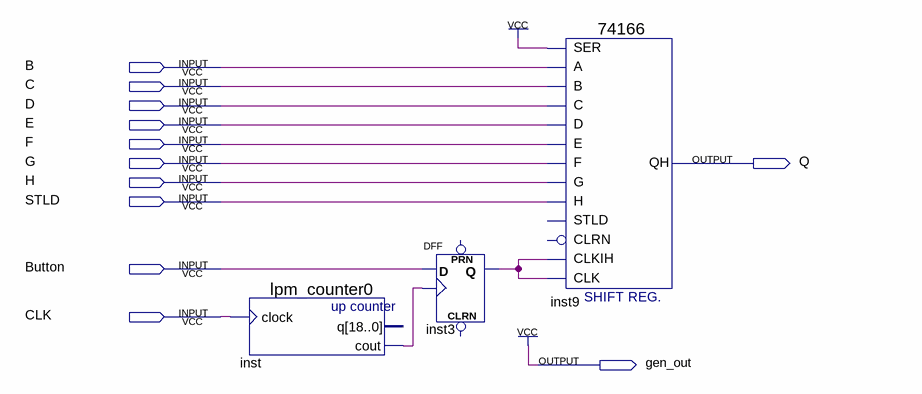
[diagram p0: schematic sheet]
// Quartus schematic scheme3.bdf as structural Verilog: 3 symbols, 12 pins
module scheme3 (
  input  B,
  input  C,
  input  D,
  input  E,
  input  F,
  input  G,
  input  H,
  input  STLD,
  input  Button,
  input  CLK,
  output Q,
  output gen_out
);

  wire inst3_q, inst_cout;

  lpm_counter0 inst (.clock(CLK), .cout(inst_cout));  // open: q
  DFF inst3 (.CLK(inst_cout), .D(Button), .Q(inst3_q));  // open: CLRN, PRN
  \74166  inst9 (
    .SER(1'b1), .A(B), .C(D), .D(E), .E(F), .B(C), .H(STLD), .G(H), .F(G), .CLK(inst3_q), .CLKIH(inst3_q),
    .QH(Q));  // open: STLD, CLRN

  assign gen_out = 1'b1;
endmodule
